# Altium schematic sheet IHM.SchDoc
size A4; SheetNumber: 2; SheetTotal: 7
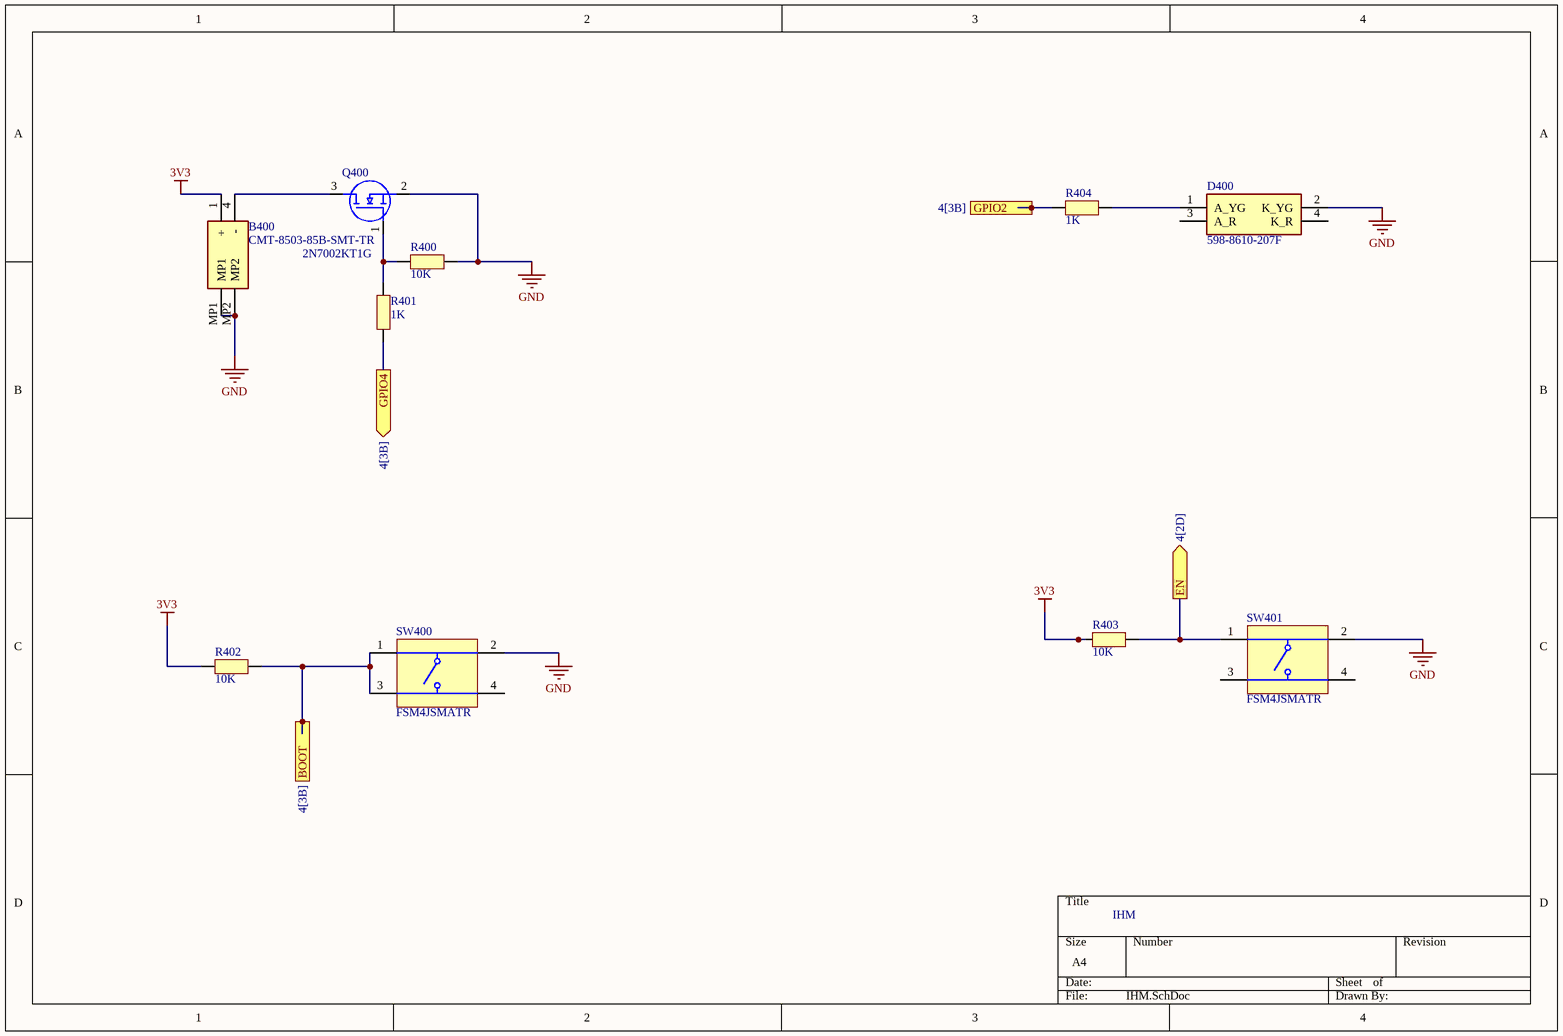
[diagram p0: IHM.SchDoc]

## Parts
B400  CMT-8503-85B-SMT-TR  [CMT850385BSMTTR]
D400  598-8610-207F  [5988610207F]
Q400  2N7002KT1G  [SOT96P237X111-3N]
R400  10K  [RESC1005X06N]
R401  1K  [RESC1005X06N]
R402  10K  [RESC1005X06N]
R403  10K  [RESC1005X06N]
R404  1K  [RESC1005X06N]
SW400  FSM4JSMATR  [TECO-FSM4JSMATR_V]
SW401  FSM4JSMATR  [TECO-FSM4JSMATR_V]

## Ports
BOOT (out, see 4[3B]), EN (out, see 4[2D]), GPIO2 (in, see 4[3B]), GPIO4 (out, see 4[3B])

## Nets
3V3: B400.1(+) R402.2 R403.2
GND: B400.MP1 B400.MP2 D400.2(K_YG) Q400.2(S) R400.2 SW400.2 SW401.2
BOOT: R402.1 SW400.1 SW400.3 ; port BOOT
EN: R403.1 SW401.1 ; port EN
GPIO2: R404.2 ; port GPIO2
GPIO4: R401.1 ; port GPIO4
NetB400_4: B400.4(-) Q400.3(D)
NetD400_1: D400.1(A_YG) R404.1
NetQ400_1: Q400.1(G) R400.1 R401.2

Not connected (* = marked no-connect by the designer): D400 3(A_R) 4(K_R); SW400 4; SW401 3 4

## Notes on the sheet
- IHM

## Library data of the parts
B400 = CMT-8503-85B-SMT-TR: Speakers & Transducers buzzer, 8.5 mm, 3 mm deep, M, 3.6 V, 85 dB, Surface Mount (SMT), Audio Transducer; Manufacturer_Name: Same Sky; Manufacturer_Part_Number: CMT-8503-85B-SMT-TR; Mouser Part Number: 490-CMT-850385BSMTTR
D400 = 598-8610-207F: Standard LEDs - SMD Red/Green WC 80/50mcd 645/570nm; Manufacturer_Name: Dialight; Geometry.Height: 0.8mm; Manufacturer_Part_Number: 598-8610-207F; Mouser Part Number: 645-598-8610-207F; Mouser Price/Stock: https://www.mouser.co.uk/ProductDetail/Dialight/598-8610-207F?qs=7JStj%2FjQ2SFuCjosqwklHQ%3D%3D; Arrow Part Number: 598-8610-207F; Arrow Price/Stock: https://www.arrow.com/en/products/598-8610-207f/dialight?region=nac; Datasheet Link: https://media.digikey.com/pdf/Data%20Sheets/Dialight%20PDFs/598%20Series%201210%20Pkg%20Bi-Color.pdf
Q400 = 2N7002KT1G: MOSFET N-Ch 60V 380mA Small Signal SOT23 ON Semiconductor 2N7002KT1G N-channel MOSFET Transistor, 380 mA, 60 V, 3-Pin SOT-23; Manufacturer_Name: onsemi; Geometry.Height: 1.11mm; Manufacturer_Part_Number: 2N7002KT1G; Mouser Part Number: 863-2N7002KT1G; Mouser Price/Stock: https://www.mouser.co.uk/ProductDetail/onsemi/2N7002KT1G?qs=Jh7l0IbPjifUiTytu%252BGGDQ%3D%3D; Arrow Part Number: 2N7002KT1G; Arrow Price/Stock: https://www.arrow.com/en/products/2n7002kt1g/on-semiconductor?utm_currency=USD&region=nac; Datasheet Link: http://www.onsemi.com/pub/Collateral/2N7002K-D.PDF
R400-R404 = Resistor
SW400 SW401 = CMP-2000-07486-1: Micro Miniature Push Button Switch FSM JSM, 50 mA, -35 to 85 degC, 4-Pin SMD, RoHS, Tape and Reel; Manufacturer: TE Connectivity; Mechanical Life: 100000Cycles; Current Rating: 50mA; Actuator Material: Polyamide; Max Voltage Rating (DC): 12V; Capacitance: 0f; Illumination Type: Illuminated; Voltage Rating (DC): 24V; Case\/Package: SMD/SMT; Operating Force: 160gf; Contact Resistance: 100mOhm; Actuator Length: 0.055inch; Switch Travel: 0.25mm; Throw Configuration: SPST; Termination: GullWing; Contact Plating: Silver; Orientation: Straight; Mounting Technology: SurfaceMount; REACH SVHC: Unknown; Electrical Life: 100000Cycles; Package Reference: FSM4JSMATR; Max Operating Temperature: 85degC; Manufacturer URL: http://www.te.com/; Package Description: 4-Pin Surface Mount Device, Body 6 x 6 mm, Pitch 4.5 mm; Datasheet Version: Rev. V, 02/2015; Packaging: TapeandReel; Min Operating Temperature: -35degC; Mount: SurfaceMount; Contact Current Rating: 50mA; Contact Material: CopperAlloy; Package Quantity: 1200; Datasheet URL: http://www.te.com/commerce/DocumentDelivery/DDEController?Action=showdoc&DocId=Customer+Drawing%7F2-1437565-7%7FV%7Fpdf%7FEnglish%7FENG_CD_2-1437565-7_V.pdf%7F4-1437565-2; RoHSCompliant: true